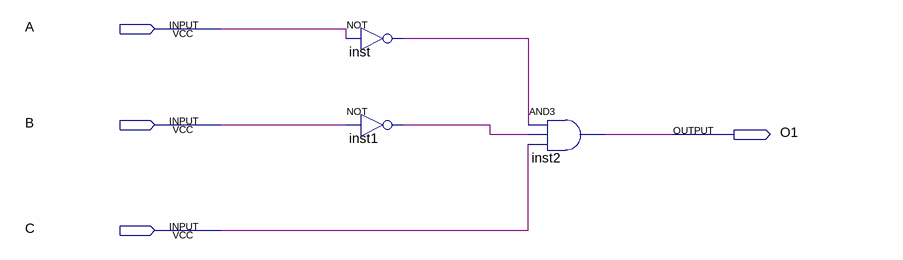
[diagram p0: schematic sheet]
// Quartus schematic F1.bdf as structural Verilog: 3 symbols, 4 pins
module F1 (
  input  A,
  input  B,
  input  C,
  output O1
);

  wire inst1_out, inst_out;

  not inst (inst_out, A);
  not inst1 (inst1_out, B);
  and inst2 (O1, inst_out, inst1_out, C);
endmodule
